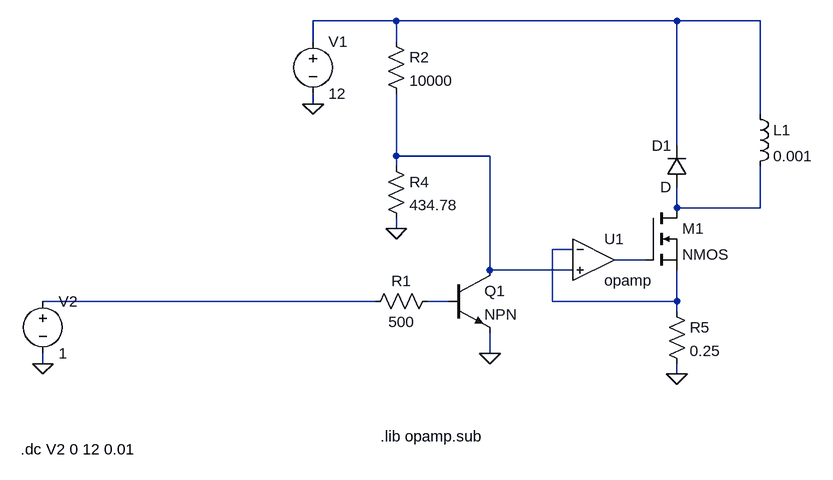
[diagram p0: schematic CompleteDriver.asc]
CompleteDriver.asc, the LTspice schematic file:
Version 4
SHEET 1 880 680
WIRE 32 -224 -96 -224
WIRE 464 -224 32 -224
WIRE 592 -224 464 -224
WIRE -96 -192 -96 -224
WIRE 32 -192 32 -224
WIRE -96 -96 -96 -112
WIRE 592 -80 592 -224
WIRE 464 -32 464 -224
WIRE 32 -16 32 -112
WIRE 176 -16 32 -16
WIRE 32 0 32 -16
WIRE 464 64 464 32
WIRE 592 64 592 0
WIRE 592 64 464 64
WIRE 32 96 32 80
WIRE 304 128 272 128
WIRE 416 144 368 144
WIRE 176 160 176 -16
WIRE 304 160 176 160
WIRE 0 208 -512 208
WIRE 112 208 80 208
WIRE 272 208 272 128
WIRE 464 208 464 160
WIRE 464 208 272 208
WIRE 464 224 464 208
WIRE 176 288 176 256
WIRE -512 304 -512 288
WIRE 464 320 464 304
FLAG -96 -96 0
FLAG 176 288 0
FLAG 32 96 0
FLAG 464 320 0
FLAG -512 304 0
DATAFLAG 32 -224 ""
DATAFLAG 176 -16 ""
DATAFLAG 592 48 ""
DATAFLAG 464 208 ""
SYMBOL npn 112 160 R0
SYMATTR InstName Q1
SYMBOL res 16 -208 R0
SYMATTR InstName R2
SYMATTR Value 10000
SYMBOL res 16 -16 R0
SYMATTR InstName R4
SYMATTR Value 434.78
SYMBOL voltage -96 -208 R0
WINDOW 123 0 0 Left 2
WINDOW 39 0 0 Left 2
SYMATTR InstName V1
SYMATTR Value 12
SYMBOL Opamps\\opamp 336 80 R0
SYMATTR InstName U1
SYMBOL nmos 416 64 R0
SYMATTR InstName M1
SYMBOL res 448 208 R0
SYMATTR InstName R5
SYMATTR Value 0.25
SYMBOL diode 480 32 R180
WINDOW 0 24 64 Left 2
WINDOW 3 24 0 Left 2
SYMATTR InstName D1
SYMBOL ind 576 -96 R0
SYMATTR InstName L1
SYMATTR Value 0.001
SYMBOL voltage -512 192 R0
WINDOW 123 0 0 Left 2
WINDOW 39 0 0 Left 2
SYMATTR InstName V2
SYMATTR Value 1
SYMBOL res 96 192 R90
WINDOW 0 0 56 VBottom 2
WINDOW 3 32 56 VTop 2
SYMATTR InstName R1
SYMATTR Value 500
TEXT 8 416 Left 2 !.lib opamp.sub
TEXT -546 436 Left 2 !.dc V2 0 12 0.01

The netlist it stands for:
* CompleteDriver.asc
Q1 N002 N007 0 0 NPN
R2 N001 N002 10000
R4 N002 0 434.78
V1 N001 0 12
XU1 N004 N002 N005 opamp Aol=100K GBW=10Meg  ; pins invin noninvin out
M1 N003 N005 N004 N004 NMOS
R5 N004 0 0.25
D1 N003 N001 D
L1 N001 N003 0.001
V2 N006 0 1
R1 N007 N006 500
.model D D
.lib standard.dio
.model NPN NPN
.model PNP PNP
.lib standard.bjt
.model NMOS NMOS
.model PMOS PMOS
.lib standard.mos
.lib opamp.sub
.dc V2 0 12 0.01
.backanno
.end